# EAGLE design W705X (EAGLE 6.6.0)
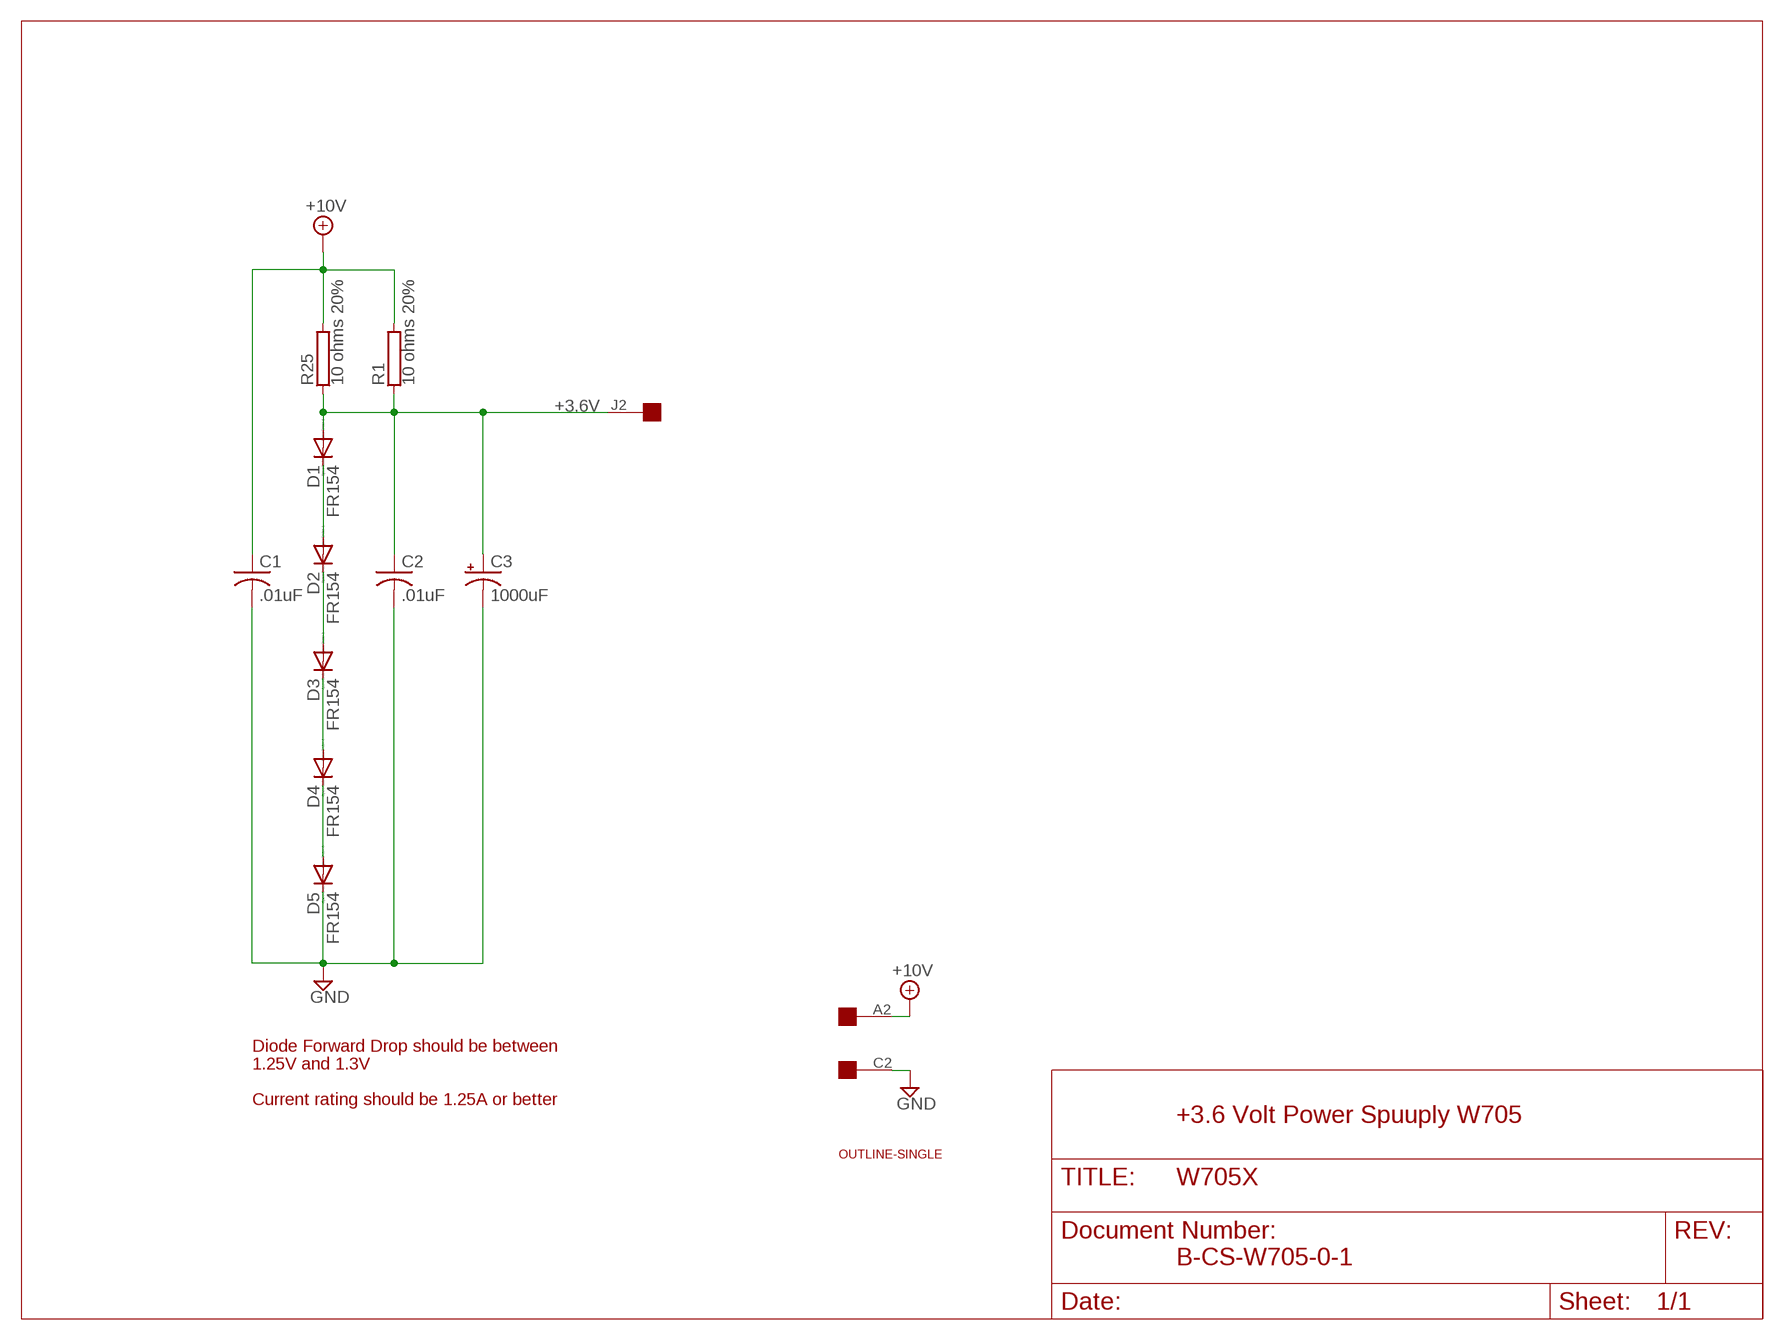
[diagram p0: schematic, sheet 1]

## Parts
C1  .01uF  C-US050-025X075  [C050-025X075]
C2  .01uF  C-US050-025X075  [C050-025X075]
C3  1000uF  CPOL-USE55-25AXIAL  [E55-25]
D1  FR154  1N4004  [DO41-10]
D2  FR154  1N4004  [DO41-10]
D3  FR154  1N4004  [DO41-10]
D4  FR154  1N4004  [DO41-10]
D5  FR154  1N4004  [DO41-10]
R1  10 ohms 20%  RKH216-8  [KH216-8]
R25  10 ohms 20%  RKH216-8  [KH216-8]
U$1  OUTLINE-SINGLE  [SINGLE]
U$2  EDGE-1  [EDGE-CON1]

## Nets
+3.6V: C2.1 C3.+ D1.A R1.1 R25.1 U$2.J2
+10V [Supply]: C1.1 R1.2 R25.2 U$2.A2
GND [Supply]: C1.2 C2.2 C3.- D5.C U$2.C2
N$2: D1.C D2.A
N$3: D2.C D3.A
N$4: D4.C D5.A
N$5: D3.C D4.A
Unconnected: U$2.B2 U$2.D2 U$2.E2 U$2.F2 U$2.H2 U$2.K2 U$2.L2 U$2.M2 U$2.N2 U$2.P2 U$2.R2 U$2.S2 U$2.T2 U$2.U2 U$2.V2

## Notes on the sheet
- Diode Forward Drop should be between
- 1.25V and 1.3V
- Current rating should be 1.25A or better
- +3.6 Volt Power Spuuply W705
- B-CS-W705-0-1

## Library data of the parts
C1 C2 = rcl:C-US: CAPACITOR, American symbol
C3 = rcl:CPOL-US: POLARIZED CAPACITOR, American symbol
D1-D5 = diode:1N4004: DIODE general purpose rectifier, 1 A
R1 R25 = resistor-power:R: Power Resitor; OC_FARNELL: unknown; OC_NEWARK: unknown
U$1 = dec-con:OUTLINE-*: Board outlines for DEC boards.
U$2 = dec-con:EDGE-1: Single-Sided DEC Edge Connector -- (side 2)

## Net classes
1 Supply: width 0.813 mm

## Board
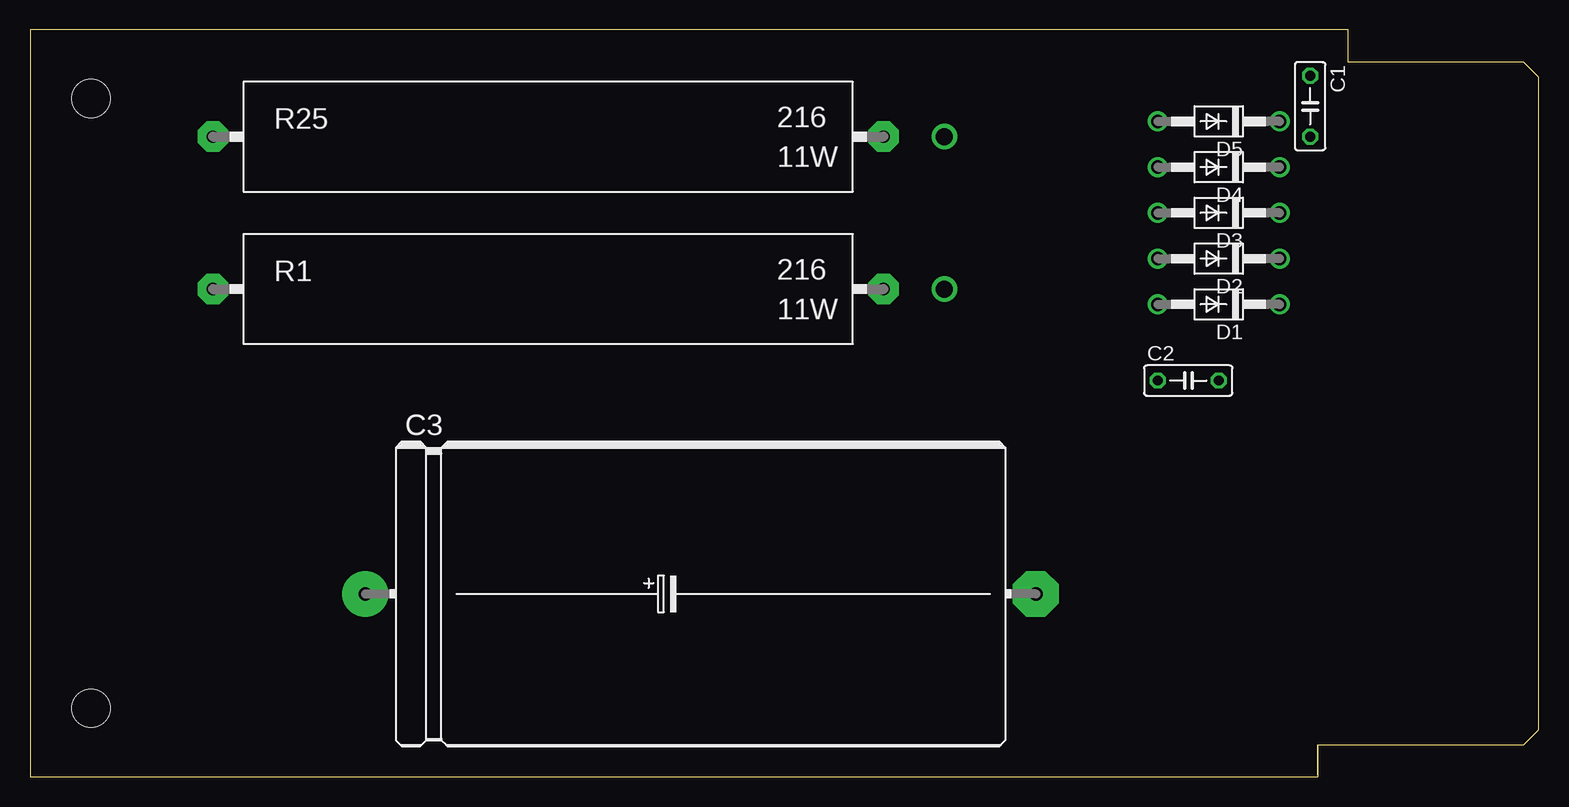
[diagram p1: board, top side]
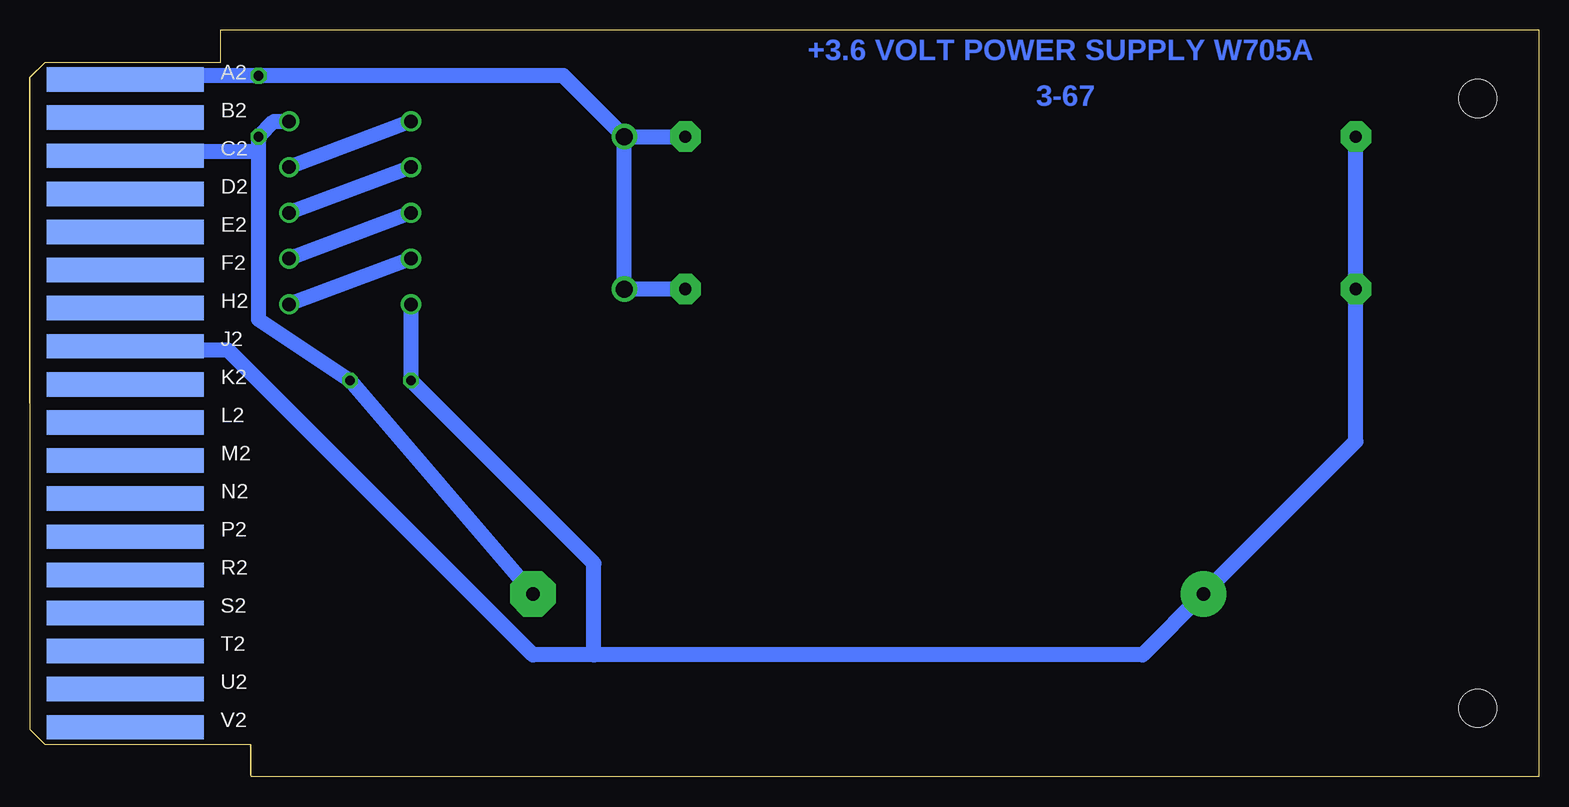
[diagram p2: board, bottom side, seen from below]

Size 125.73 x 62.23 mm. Coordinates in mm from the lower left corner, seen from the top.
Copper layers (1+16): Top 0.035mm / dielectric 1.5mm / Bottom 0.035mm
Design rules "16mils": minimum track width 16mil, minimum drill 32mil, track to track 15mil, track to pad 10mil, pad to pad 10mil, via to via 10mil, smd to smd 10mil, copper to edge 13mil, drill to drill 10mil, minimum pad ring 10mil, minimum via ring 8mil, stop-mask expansion 0mil, vias tented up to drill 0mil, thermal gap 10mil

### Footprints (pad centres in the part's own frame; a part is rotated, then mirrored left to right if it is on the bottom)
C050-025X075 = drill 0.813 octagon: 1 -2.54,0; 2 2.54,0
E55-25 = drill 1.118 pad 3.81: + -27.94,0 | drill 1.118 pad 3.81 octagon: - 27.94,0
DO41-10 = drill 1.118: A 5.08,0; C -5.08,0
KH216-8 = drill 1.016 pad 2.54 octagon: 1 -27.94,0; 2 27.94,0
SINGLE = hole 3.175: 120.65,56.515; 120.65,5.715
EDGE-CON1 = smd 13.106 x 2.032 bottom: A2 7.938,4.128; B2 7.938,7.303; C2 7.938,10.477; D2 7.938,13.652; E2 7.938,16.828; F2 7.938,20.003; H2 7.938,23.177; J2 7.938,26.352; K2 7.938,29.527; L2 7.938,32.703; M2 7.938,35.877; N2 7.938,39.053; P2 7.938,42.227; R2 7.938,45.403; S2 7.938,48.578; T2 7.938,51.752; U2 7.938,54.928; V2 7.938,58.102

### Placement (x,y rotation side)
C1  106.68,55.88 270 top
C2  96.52,33.02 0 top
C3  55.88,15.24 0 top
D1  99.06,39.37 180 top
D2  99.06,43.18 180 top
D3  99.06,46.99 180 top
D4  99.06,50.8 180 top
D5  99.06,54.61 180 top
R1  43.18,40.64 0 top
R25  43.18,53.34 0 top
U$1  125.73,62.23 180 top
U$2  125.73,62.23 180 top

### Tracks (layer width: path | path; a pad name or v marks a point on that pad's centre or on a via)
+3.6V
  Bottom 1.27: D1.A C2.1 78.74,17.78 78.74,10.16 | U$2.J2 117.73,35.56 109.22,35.56 83.82,10.16 78.74,10.16 | 78.74,10.16 33.02,10.16 C3.+ 15.24,27.94 R1.1 R25.1
+10V  (via drill 1.42)
  Bottom 0.813: 116.84,58.42 117.22,58.04
  Bottom 1.27: 117.22,58.04 U$2.A2 | 116.84,58.42 C1.1 81.28,58.42 v76.2,53.34 | R1.2 v76.2,40.64 v76.2,53.34 | v76.2,53.34 R25.2
GND
  Bottom 1.27: U$2.C2 117.17,51.74 116.84,52.07 106.68,52.07 | D5.C 105.41,54.61 C1.2 106.68,52.07 | 106.68,52.07 106.68,38.1 C2.2 C3.-
N$2
  Bottom 1.27: D2.A D1.C
N$3
  Bottom 1.27: D3.A D2.C
N$4
  Bottom 1.27: D5.A D4.C
N$5
  Bottom 1.27: D4.A D3.C

### Text on the board
Bottom: +3.6 VOLT POWER SUPPLY W705A | 3-67